# Altium schematic sheet [1] - POWER.SchDoc
size A
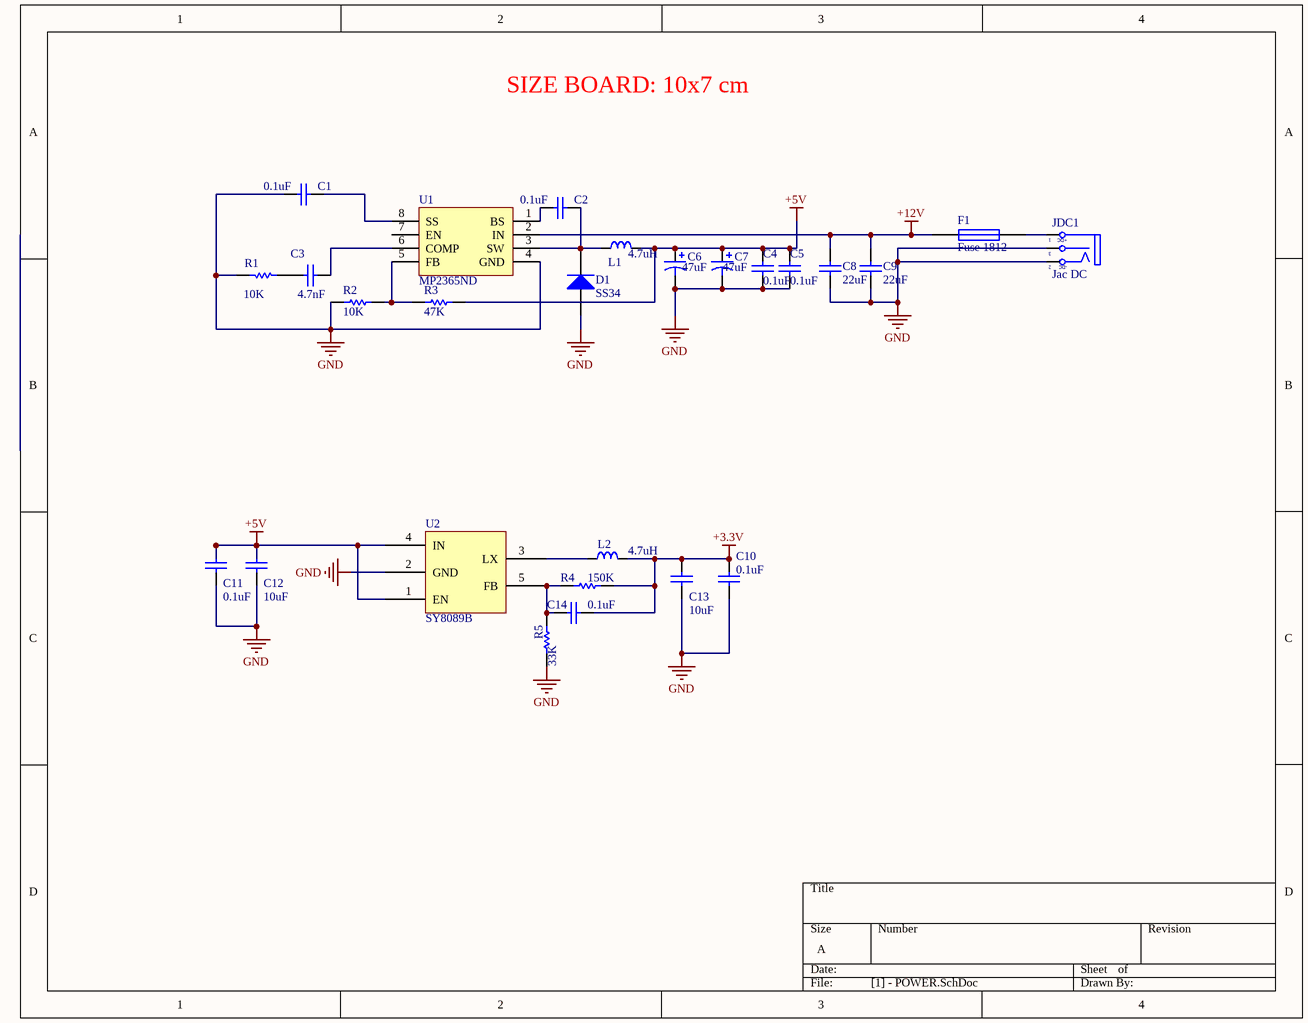
[diagram p0: [1] - POWER.SchDoc]

## Parts
C1  0.1uF  [CN-SMD-0603]
C2  0.1uF  [CN-SMD-0603]
C3  4.7nF  [CN-SMD-0603]
C4  0.1uF  [CN-SMD-0603]
C5  0.1uF  [CN-SMD-0603]
C6  47uF  [Cap size C]
C7  47uF  [Cap size C]
C8  22uF  [CN-SMD-0805]
C9  22uF  [CN-SMD-0805]
C10  0.1uF  [CN-SMD-0603]
C11  0.1uF  [CN-SMD-0603]
C12  10uF  [CN-SMD-0805]
C13  10uF  [CN-SMD-0805]
C14  0.1uF  [CN-SMD-0603]
D1  SS34  [DO-214AC]
F1  Fuse 1812  [fuse_1812]
JDC1  Jac DC  [DC0]
L1  4.7uH  [INDUCTOR CD75]
L2  4.7uH  [INDUCTOR CD75]
R1  10K  [RES 0603]
R2  10K  [RES 0603]
R3  47K  [RES 0603]
R4  150K  [RES 0603]
R5  33K  [RES 0603]
U1  MP2365ND  [MP2365ND]
U2  SY8089B  [SOT23-5]

## Nets
+3.3V: C10.1 C13.2 C14.1 L2.2 R4.1
+5V: C4.2 C5.2 C6.1 C7.1 C11.2 C12.2 L1.1 R3.2 U2.1(EN) U2.4(IN)
+12V: C8.1 C9.2 F1.1 U1.2(IN)
GND: C1.1 C4.1 C5.1 C6.2 C7.2 C8.2 C9.1 C10.2 C11.1 C12.1 C13.1 D1.1(A) JDC1.2(TN) JDC1.3(S) R1.2 R2.1 R5.1 U1.4(GND) U2.2(GND)
NetC1_2: C1.2 U1.8(SS)
NetC2_1: C2.1 U1.1(BS)
NetC2_2: C2.2 D1.2(K) L1.2 U1.3(SW)
NetC3_1: C3.1 R1.1
NetC3_2: C3.2 U1.6(COMP)
NetC14_2: C14.2 R4.2 R5.2 U2.5(FB)
NetF1_2: F1.2 JDC1.1(T)
NetL2_1: L2.1 U2.3(LX)
NetR2_2: R2.2 R3.1 U1.5(FB)

Not connected (* = marked no-connect by the designer): U1 7(EN)

## Notes on the sheet
- SIZE BOARD: 10x7 cm
- (in symbol DCIN_1) +DC; -DC

## Library data of the parts
C1 C2 C4 C5 C10 C11 C14 = CN0603-0.1uF: CC0603KPX7R9BB104 0603 0.1 uF 50 V ±10% Tolerance X7R SMT Multilayer Ceramic Capacitor; Manufacturer 1: Yageo; Capacitance: 100nF; Voltage Rating: 50V; Supplier 1: Digi-Key; Manufacturer Part Number 1: CC0603KPX7R9BB104; Stock 1: 190619; Pricing 1: 1=0.10000, 10=0.06200, 100=0.02780, 500=0.01988, 1000=0.01562, 2500=0.01420, 5000=0.01306 (USD); Mount: Surface Mount; Case/Package: 0603; Number of Pins: 2; Weight: 7.1E-05oz; Case Code (Imperial): 0603; Case Code (Metric): 1608; Min Operating Temperature: -55°C; Max Operating Temperature: 125°C; Tolerance: 10%; Packaging: Tape and Reel; Dielectric: X7R; Voltage Rating (DC): 50V; Termination: SMD/SMT; Composition: Ceramic; Length: 1.6mm; Height: 0.8mm; Width: 0.031inch; Thickness: 0.035inch; Depth: 0.8mm; Radiation Hardening: No; Lead Free: Lead Free; Halogen Free: Halogen Free; ComponentLink1URL: https://datasheet.ciiva.com/26829/getdatasheetpartid-653026-26829414.pdf?src-supplier=Verical; ComponentLink1Description: https://datasheet.ciiva.com/26829/getdatasheetpartid-653026-26829414.pdf?src-supplier=Verical; ComponentLink2URL: http://datasheet.octopart.com/CC0603KPX7R9BB104-Yageo-datasheet-10883670.pdf; ComponentLink2Description: http://datasheet.octopart.com/CC0603KPX7R9BB104-Yageo-datasheet-10883670.pdf; ComponentLink3URL: http://datasheet.octopart.com/CC0603KPX7R9BB104-Yageo-datasheet-68298032.pdf?src-supplier=Future+Electronics; ComponentLink3Description: http://datasheet.octopart.com/CC0603KPX7R9BB104-Yageo-datasheet-68298032.pdf?src-supplier=Future+Electronics; ComponentLink4URL: http://datasheet.octopart.com/CC0603KPX7R9BB104-Yageo-datasheet-78855685.pdf?src-supplier=Future+Electronics; ComponentLink4Description: http://datasheet.octopart.com/CC0603KPX7R9BB104-Yageo-datasheet-78855685.pdf?src-supplier=Future+Electronics; ComponentLink5URL: http://datasheet.octopart.com/CC0603KPX7R9BB104-Yageo-datasheet-82288757.pdf?src-supplier=Future+Electronics; ComponentLink5Description: http://datasheet.octopart.com/CC0603KPX7R9BB104-Yageo-datasheet-82288757.pdf?src-supplier=Future+Electronics; ComponentLink6URL: http://datasheet.octopart.com/CC0603KPX7R9BB104-Yageo-datasheet-137700084.pdf?src-supplier=Future+Electronics; ComponentLink6Description: http://datasheet.octopart.com/CC0603KPX7R9BB104-Yageo-datasheet-137700084.pdf?src-supplier=Future+Electronics
C3 = CN0603-4.7nF: CC0603KRX7R9BB472 Surface Mount Ceramic Multilayer Capacitor 0.0047uF 10% X7R 50V 0603 Paper T/R; Manufacturer 1: Yageo; Insulation Resistance: 10GR; Dissipation Factor: 2.5%; Supplier 1: Digi-Key; Manufacturer Part Number 1: CC0603KRX7R9BB472; Stock 1: 731800; Pricing 1: 1=0.10000, 10=0.05200, 100=0.02320, 500=0.01656, 1000=0.01301 (USD); Mount: Surface Mount; Case/Package: 0603; Number of Pins: 2; Case Code (Imperial): 0603; Case Code (Metric): 1608; Dielectric Material: Ceramic; Material: Ceramic; Min Operating Temperature: -55°C; Max Operating Temperature: 125°C; Capacitance: 4.7nF; Voltage Rating: 50V; Voltage Rating (DC): 50V; Tolerance: 10%; Packaging: Tape and Reel; Dielectric: X7R; Composition: Ceramic; Termination: SMD/SMT; Package Quantity: 1; Voltage: 50V; Length: 1.6mm; Height: 0.8mm; Width: 0.8mm; Thickness: 0.035inch; Depth: 0.8mm; Radiation Hardening: No; Lead Free: Lead Free; Halogen Free: Halogen Free; REACH SVHC: Unknown; ComponentLink1URL: https://datasheet.ciiva.com/144/mlccorderingcode-144445.pdf?src-supplier=Digi-Key; ComponentLink1Description: https://datasheet.ciiva.com/144/mlccorderingcode-144445.pdf?src-supplier=Digi-Key; ComponentLink2URL: https://datasheet.ciiva.com/144/mlccorderingcode-144446.pdf?src-supplier=Digi-Key; ComponentLink2Description: https://datasheet.ciiva.com/144/mlccorderingcode-144446.pdf?src-supplier=Digi-Key; ComponentLink3URL: https://datasheet.ciiva.com/144/mlccorderingcode-144447.pdf?src-supplier=Digi-Key; ComponentLink3Description: https://datasheet.ciiva.com/144/mlccorderingcode-144447.pdf?src-supplier=Digi-Key; ComponentLink4URL: https://datasheet.ciiva.com/11464/upy-gphc-x7r-6-3v-to-50v-8-11464743.pdf?src-supplier=Avnet; ComponentLink4Description: https://datasheet.ciiva.com/11464/upy-gphc-x7r-6-3v-to-50v-8-11464743.pdf?src-supplier=Avnet; ComponentLink5URL: https://datasheet.ciiva.com/16625/upy-gphc-x7r-6-3v-to-50v-8-16625534.pdf?src-supplier=Avnet+Europe; ComponentLink5Description: https://datasheet.ciiva.com/16625/upy-gphc-x7r-6-3v-to-50v-8-16625534.pdf?src-supplier=Avnet+Europe; ComponentLink6URL: https://datasheet.ciiva.com/8033/1489800-8033903.pdf?src-supplier=Element14; ComponentLink6Description: https://datasheet.ciiva.com/8033/1489800-8033903.pdf?src-supplier=Element14; ComponentLink7URL: http://datasheet.octopart.com/CC0603KRX7R9BB472-Yageo-datasheet-10883670.pdf; ComponentLink7Description: http://datasheet.octopart.com/CC0603KRX7R9BB472-Yageo-datasheet-10883670.pdf; ComponentLink8URL: http://datasheet.octopart.com/CC0603KRX7R9BB472-Yageo-datasheet-62336348.pdf?src-supplier=Newark; ComponentLink8Description: http://datasheet.octopart.com/CC0603KRX7R9BB472-Yageo-datasheet-62336348.pdf?src-supplier=Newark; ComponentLink9URL: http://datasheet.octopart.com/CC0603KRX7R9BB472-Yageo-datasheet-5301394.pdf?src-supplier=Newark; ComponentLink9Description: http://datasheet.octopart.com/CC0603KRX7R9BB472-Yageo-datasheet-5301394.pdf?src-supplier=Newark; ComponentLink10URL: http://datasheet.octopart.com/CC0603KRX7R9BB472-Yageo-datasheet-15895757.pdf?src-supplier=Future+Electronics; ComponentLink10Description: http://datasheet.octopart.com/CC0603KRX7R9BB472-Yageo-datasheet-15895757.pdf?src-supplier=Future+Electronics; ComponentLink11URL: http://datasheet.octopart.com/CC0603KRX7R9BB472-Yageo-datasheet-27626582.pdf?src-supplier=Future+Electronics; ComponentLink11Description: http://datasheet.octopart.com/CC0603KRX7R9BB472-Yageo-datasheet-27626582.pdf?src-supplier=Future+Electronics; ComponentLink12URL: http://datasheet.octopart.com/CC0603KRX7R9BB472-Yageo-datasheet-30457685.pdf?src-supplier=Seeed+Studio; ComponentLink12Description: http://datasheet.octopart.com/CC0603KRX7R9BB472-Yageo-datasheet-30457685.pdf?src-supplier=Seeed+Studio; ComponentLink13URL: http://datasheet.octopart.com/CC0603KRX7R9BB472-Yageo-datasheet-17600895.pdf?src-supplier=TME; ComponentLink13Description: http://datasheet.octopart.com/CC0603KRX7R9BB472-Yageo-datasheet-17600895.pdf?src-supplier=TME; ComponentLink14URL: http://datasheet.octopart.com/CC0603KRX7R9BB472-Yageo-datasheet-137700084.pdf?src-supplier=Future+Electronics; ComponentLink14Description: http://datasheet.octopart.com/CC0603KRX7R9BB472-Yageo-datasheet-137700084.pdf?src-supplier=Future+Electronics; ComponentLink15URL: http://datasheet.octopart.com/CC0603KRX7R9BB472-Yageo-datasheet-118396.pdf?src-supplier=Digi-Key; ComponentLink15Description: http://datasheet.octopart.com/CC0603KRX7R9BB472-Yageo-datasheet-118396.pdf?src-supplier=Digi-Key; ComponentLink16URL: http://datasheet.octopart.com/CC0603KRX7R9BB472-Yageo-datasheet-8324192.pdf?src-supplier=Future+Electronics; ComponentLink16Description: http://datasheet.octopart.com/CC0603KRX7R9BB472-Yageo-datasheet-8324192.pdf?src-supplier=Future+Electronics; ComponentLink17URL: http://datasheet.octopart.com/CC0603KRX7R9BB472-Yageo-datasheet-499490.pdf?src-supplier=Element14; ComponentLink17Description: http://datasheet.octopart.com/CC0603KRX7R9BB472-Yageo-datasheet-499490.pdf?src-supplier=Element14; ComponentLink18URL: http://datasheet.octopart.com/CC0603KRX7R9BB472-Yageo-datasheet-8701427.pdf?src-supplier=Element14; ComponentLink18Description: http://datasheet.octopart.com/CC0603KRX7R9BB472-Yageo-datasheet-8701427.pdf?src-supplier=Element14; ComponentLink19URL: http://datasheet.octopart.com/CC0603KRX7R9BB472-Yageo-datasheet-12526321.pdf?src-supplier=Future+Electronics; ComponentLink19Description: http://datasheet.octopart.com/CC0603KRX7R9BB472-Yageo-datasheet-12526321.pdf?src-supplier=Future+Electronics
C6 C7 = CN6032-47uF: TPSC476M016R0350 CAP TANT 47UF 16V 20% 2312; Manufacturer 1: Kyocera AVX; Dielectric Material: Tantalum; ESR (Equivalent Series Resistance): 350mR; Polarity: Polar; Dissipation Factor: 6%; Supplier 1: Digi-Key; Manufacturer Part Number 1: TPSC476M016R0350; Stock 1: 3387; Pricing 1: 1=1.31000, 10=1.03500, 100=0.77630 (USD); RoHS: Yes; Mount: Surface Mount; Case/Package: Molded; Number of Pins: 2; Case Code (Imperial): 2312; Case Code (Metric): 6032; Min Operating Temperature: -55°C; Max Operating Temperature: 125°C; Capacitance: 47uF; Tolerance: 20%; Packaging: Tape and Reel; Voltage Rating: 16V; Package Quantity: 1; Termination: SMD/SMT; Voltage Rating (DC): 16V; Voltage: 16V; Features: General Purpose; Length: 6mm; Height: 2.8mm; Depth: 3.2mm; Width: 3.2mm; Height - Seated (Max): 0.11inch; Radiation Hardening: No; REACH SVHC: No SVHC; Lead Free: Lead Free; ComponentLink1URL: https://datasheet.ciiva.com/264/tps-264405.pdf?src-supplier=Digi-Key; ComponentLink1Description: https://datasheet.ciiva.com/264/tps-264405.pdf?src-supplier=Digi-Key; ComponentLink2URL: https://datasheet.ciiva.com/264/tps-264406.pdf?src-supplier=Digi-Key; ComponentLink2Description: https://datasheet.ciiva.com/264/tps-264406.pdf?src-supplier=Digi-Key; ComponentLink3URL: https://datasheet.ciiva.com/22667/1724878-22667574.pdf?src-supplier=Element14; ComponentLink3Description: https://datasheet.ciiva.com/22667/1724878-22667574.pdf?src-supplier=Element14; ComponentLink4URL: https://datasheet.ciiva.com/264/tps-264407.pdf?src-supplier=Digi-Key; ComponentLink4Description: https://datasheet.ciiva.com/264/tps-264407.pdf?src-supplier=Digi-Key; ComponentLink5URL: https://datasheet.ciiva.com/28514/1724878-28514871.pdf?src-supplier=Element14; ComponentLink5Description: https://datasheet.ciiva.com/28514/1724878-28514871.pdf?src-supplier=Element14
C8 C9 = CN0805-22uF: CC0805MKX5R6BB226 0805 22 uF 10 V ±20 % Tolerance X5R SMT Multilayer Ceramic Capacitor; Manufacturer 1: Yageo; Tolerance: 20%; Voltage Rating: 10V; Supplier 1: Digi-Key; Manufacturer Part Number 1: CC0805MKX5R6BB226; Stock 1: 18000; Pricing 1: 1=0.41000, 10=0.28800, 100=0.17290, 500=0.12966, 1000=0.10950 (USD); Mount: Surface Mount; Case/Package: 0805; Weight: 0.000194oz; Case Code (Imperial): 0805; Case Code (Metric): 2012; Min Operating Temperature: -55°C; Max Operating Temperature: 85°C; Capacitance: 22uF; Packaging: Tape and Reel; Dielectric: X5R; Voltage Rating (DC): 10V; Termination: SMD/SMT; Composition: Ceramic; Length: 2mm; Width: 1.25mm; Thickness: 0.057inch; Depth: 1.25mm; Radiation Hardening: No; Lead Free: Lead Free; Halogen Free: Halogen Free; ComponentLink1URL: https://datasheet.ciiva.com/26863/getdatasheetpartid-573628-26863004.pdf?src-supplier=Verical; ComponentLink1Description: https://datasheet.ciiva.com/26863/getdatasheetpartid-573628-26863004.pdf?src-supplier=Verical; ComponentLink2URL: http://datasheet.octopart.com/CC0805MKX5R6BB226-Yageo-datasheet-24580494.pdf?src-supplier=Future+Electronics; ComponentLink2Description: http://datasheet.octopart.com/CC0805MKX5R6BB226-Yageo-datasheet-24580494.pdf?src-supplier=Future+Electronics; ComponentLink3URL: http://datasheet.octopart.com/CC0805MKX5R6BB226-Yageo-datasheet-27626583.pdf?src-supplier=Future+Electronics; ComponentLink3Description: http://datasheet.octopart.com/CC0805MKX5R6BB226-Yageo-datasheet-27626583.pdf?src-supplier=Future+Electronics; ComponentLink4URL: http://datasheet.octopart.com/CC0805MKX5R6BB226-Yageo-datasheet-86397281.pdf?src-supplier=Future+Electronics; ComponentLink4Description: http://datasheet.octopart.com/CC0805MKX5R6BB226-Yageo-datasheet-86397281.pdf?src-supplier=Future+Electronics
C12 C13 = CN0805_10uF: CC0805KKX5R8BB106 0805 10 uF 25 V ±10 % Tolerance X5R SMT Multilayer Ceramic Capacitor; Manufacturer 1: Yageo; Tolerance: 10%; Voltage Rating: 25V; Supplier 1: Digi-Key; Manufacturer Part Number 1: CC0805KKX5R8BB106; Stock 1: 905270; Pricing 1: 1=0.48000, 10=0.33500, 100=0.20100, 500=0.15076, 1000=0.12730 (USD); Mount: Surface Mount; Case/Package: 0805; Weight: 0.000194oz; Case Code (Imperial): 0805; Case Code (Metric): 2012; Min Operating Temperature: -55°C; Max Operating Temperature: 85°C; Capacitance: 10uF; Packaging: Tape and Reel; Dielectric: X5R; Voltage Rating (DC): 25V; Composition: Ceramic; Termination: SMD/SMT; Length: 0.079inch; Width: 0.049inch; Depth: 1.25mm; Thickness: 0.057inch; Lead Free: Lead Free; Halogen Free: Halogen Free; ComponentLink1URL: http://www.mouser.com/ds/2/447/UPY-GPHC_X5R_4V-to-50V_25-1131599.pdf?src-supplier=Mouser; ComponentLink1Description: http://www.mouser.com/ds/2/447/UPY-GPHC_X5R_4V-to-50V_25-1131599.pdf?src-supplier=Mouser; ComponentLink2URL: http://components.arrow.com/part/dataview/0323_04166572?src-supplier=Arrow+Europe; ComponentLink2Description: http://components.arrow.com/part/dataview/0323_04166572?src-supplier=Arrow+Europe; ComponentLink3URL: http://www.yageo.com/documents/recent/UPY-GPHC_X5R_4V-to-50V_25.pdf?src-supplier=Digi-Key; ComponentLink3Description: http://www.yageo.com/documents/recent/UPY-GPHC_X5R_4V-to-50V_25.pdf?src-supplier=Digi-Key; ComponentLink4URL: http://datasheet.octopart.com/CC0805KKX5R8BB106-Yageo-datasheet-14389981.pdf?src-supplier=Seeed+Studio; ComponentLink4Description: http://datasheet.octopart.com/CC0805KKX5R8BB106-Yageo-datasheet-14389981.pdf?src-supplier=Seeed+Studio; ComponentLink5URL: http://datasheet.octopart.com/CC0805KKX5R8BB106-Yageo-datasheet-78855687.pdf?src-supplier=Future+Electronics; ComponentLink5Description: http://datasheet.octopart.com/CC0805KKX5R8BB106-Yageo-datasheet-78855687.pdf?src-supplier=Future+Electronics; ComponentLink6URL: http://datasheet.octopart.com/CC0805KKX5R8BB106-Yageo-datasheet-86397281.pdf?src-supplier=Future+Electronics; ComponentLink6Description: http://datasheet.octopart.com/CC0805KKX5R8BB106-Yageo-datasheet-86397281.pdf?src-supplier=Future+Electronics
D1 = Diode_SS34: SS34 DIODE SCHOTTKY 40V 3A SMC; Manufacturer 1: ON Semiconductor / Fairchild; Element Configuration: Single; Peak Reverse Current: 500uA; Max Forward Surge Current (Ifsm): 100A; Forward Voltage: 500mV; Polarity: Standard; Max Power Dissipation: 2.27W; Number of Elements: 1; Supplier 1: Digi-Key; Manufacturer Part Number 1: SS34; Stock 1: 1630; Pricing 1: 1=0.47000, 10=0.40600, 100=0.30310, 500=0.23816, 1000=0.18403 (USD); RoHS: Yes; Mount: Surface Mount; Case/Package: SMC; Number of Pins: 2; Contact Plating: Tin,Matte; Number of Terminals: 2; Min Operating Temperature: -55°C; Max Operating Temperature: 150°C; Packaging: Tape and Reel; Package Quantity: 1; Current Rating: 3A; Voltage Rating (DC): 40V; Forward Current: 3A; Max Repetitive Reverse Voltage (Vrrm): 40V; Output Current: 3A; Peak Non-Repetitive Surge Current: 100A; Average Rectified Current: 3A; Max Reverse Voltage (DC): 40V; Max Surge Current: 100A; Max Reverse Leakage Current: 500uA; Current: 3A; Voltage: 40V; Length: 7.15mm; Height: 2.75mm; Width: 6.25mm; Radiation Hardening: No; Lead Free: Lead Free; REACH SVHC: No SVHC; ComponentLink1URL: https://datasheet.ciiva.com/911/ss34-911088.pdf?src-supplier=Avnet; ComponentLink1Description: https://datasheet.ciiva.com/911/ss34-911088.pdf?src-supplier=Avnet; ComponentLink2URL: https://datasheet.ciiva.com/4715/ss34-197057-4715255.pdf?src-supplier=Mouser; ComponentLink2Description: https://datasheet.ciiva.com/4715/ss34-197057-4715255.pdf?src-supplier=Mouser; ComponentLink3URL: https://datasheet.ciiva.com/34301/1090087-34301975.pdf?src-supplier=Jameco; ComponentLink3Description: https://datasheet.ciiva.com/34301/1090087-34301975.pdf?src-supplier=Jameco; ComponentLink4URL: https://datasheet.ciiva.com/23832/1725604-23832651.pdf?src-supplier=Newark; ComponentLink4Description: https://datasheet.ciiva.com/23832/1725604-23832651.pdf?src-supplier=Newark; ComponentLink5URL: https://datasheet.ciiva.com/34302/1547649-34302462.pdf?src-supplier=Jameco; ComponentLink5Description: https://datasheet.ciiva.com/34302/1547649-34302462.pdf?src-supplier=Jameco; ComponentLink6URL: https://datasheet.ciiva.com/911/ss34-911086.pdf?src-supplier=Digi-Key; ComponentLink6Description: https://datasheet.ciiva.com/911/ss34-911086.pdf?src-supplier=Digi-Key; ComponentLink7URL: https://datasheet.ciiva.com/8300/ss39-8300583.pdf?src-supplier=Avnet; ComponentLink7Description: https://datasheet.ciiva.com/8300/ss39-8300583.pdf?src-supplier=Avnet; ComponentLink8URL: https://datasheet.ciiva.com/911/ss34-911085.pdf?src-supplier=Digi-Key; ComponentLink8Description: https://datasheet.ciiva.com/911/ss34-911085.pdf?src-supplier=Digi-Key; ComponentLink9URL: https://datasheet.ciiva.com/7965/1774678-7965245.pdf?src-supplier=Element14; ComponentLink9Description: https://datasheet.ciiva.com/7965/1774678-7965245.pdf?src-supplier=Element14; ComponentLink10URL: https://datasheet.ciiva.com/911/ss34-911087.pdf?src-supplier=Digi-Key; ComponentLink10Description: https://datasheet.ciiva.com/911/ss34-911087.pdf?src-supplier=Digi-Key
F1 = Fuse 1: Fuse; Manufacturer: Littelfuse; Manufacturer Part Number: MINISMDC150F/24-2; Hold Current: 1.5A; Voltage Rating (DC): 24V; Supplier 1: Digi-Key; RoHS: No; Stock 1: 56020; Pricing 1: 1 = 0.66000, 5 = 0.64400, 10 = 0.62400, 50 = 0.52480, 100 = 0.43560, 250 = 0.39600, 500 = 0.33660 (USD); Min Operating Temperature: -40°C; Max Operating Temperature: 85°C; Lead Free: Lead Free; REACH SVHC: Unknown; ComponentLink1URL: http://www.farnell.com/datasheets/2282569.pdf?src-supplier=Farnell; ComponentLink1Description: http://www.farnell.com/datasheets/2282569.pdf?src-supplier=Farnell; ComponentLink2URL: http://www.farnell.com/datasheets/1468628.pdf?src-supplier=Farnell; ComponentLink2Description: http://www.farnell.com/datasheets/1468628.pdf?src-supplier=Farnell; ComponentLink3URL: http://www.littelfuse.com/~/media/electronics/datasheets/resettable_ptcs/littelfuse_ptc_minismd_catalog_datasheet.pdf.pdf?src-supplier=Digi-Key; ComponentLink3Description: http://www.littelfuse.com/~/media/electronics/datasheets/resettable_ptcs/littelfuse_ptc_minismd_catalog_datasheet.pdf.pdf?src-supplier=Digi-Key; ComponentLink4URL: http://www.farnell.com/datasheets/1468628.pdf?src-supplier=Element14; ComponentLink4Description: http://www.farnell.com/datasheets/1468628.pdf?src-supplier=Element14; Supplier Part Number 1: MINISMDC150F24-2CT-ND
JDC1 = DCIN_1: Jac DC input; Value: Jac DC
L1 L2 = L-4.7uH: CDRH5D28RHPNP-4R7NC Fixed Inductors 4.7uH 3.05A; Manufacturer 1: Sumida; Core Material: Ferrite; Saturation Current: 3.7A; Shielding: Shielded; Tolerance: 25%; Current Rating: 2.8A; DC Resistance (DCR): 43.1mR; Test Frequency: 100kHz; Supplier 1: Digi-Key; Stock 1: 50646; Pricing 1: 1=1.53000, 10=1.42000, 100=1.02700, 500=0.78660, 1000=0.69920 (USD); Mount: Surface Mount; Case/Package: Nonstandard; Min Operating Temperature: -40°C; Max Operating Temperature: 105°C; Packaging: Tape and Reel; Inductance: 4.7uH; Max DC Current: 3.7A; Termination: SMD/SMT; Length: 0.236inch; Height: 3mm; Width: 0.232inch; Height - Seated (Max): 0.118inch; Depth: 6.2mm; Radiation Hardening: No; Lead Free: Lead Free; ComponentLink1URL: http://www.mouser.com/ds/2/390/CDRH5D28RHP-523509.pdf?src-supplier=Mouser; ComponentLink1Description: http://www.mouser.com/ds/2/390/CDRH5D28RHP-523509.pdf?src-supplier=Mouser; ComponentLink2URL: http://products.sumida.com/products/pdf/CDRH5D28RHP.pdf?src-supplier=Digi-Key; ComponentLink2Description: http://products.sumida.com/products/pdf/CDRH5D28RHP.pdf?src-supplier=Digi-Key; ComponentLink3URL: http://www.sumida.com/products/pdf/CDRH5D28,5D28R,5D28RHP.pdf?src-supplier=Avnet; ComponentLink3Description: http://www.sumida.com/products/pdf/CDRH5D28,5D28R,5D28RHP.pdf?src-supplier=Avnet; Supplier Part Number 1: 4.7uH; Manufacturer Part Number 1: CDRH5D28RHPNP-4R7NC; RoHS: Yes
R1 R2 = RC0603_10K: AC0603FR-0710KL Res Thick Film 0603 10K Ohm 1% 0.1W(1/10W) ±100ppm/C Pad SMD Automotive T/R; Manufacturer 1: Yageo; Resistance: 10kR; Temperature Coefficient: 100ppm/°C; Power Rating: 100mW; Voltage Rating: 50V; ComponentLink1URL: https://datasheet.ciiva.com/26862/getdatasheetpartid-724997-26862461.pdf?src-supplier=Verical; ComponentLink1Description: https://datasheet.ciiva.com/26862/getdatasheetpartid-724997-26862461.pdf?src-supplier=Verical; ComponentLink2URL: http://datasheet.octopart.com/AC0603FR-0710KL-Yageo-datasheet-12512238.pdf; ComponentLink2Description: http://datasheet.octopart.com/AC0603FR-0710KL-Yageo-datasheet-12512238.pdf; ComponentLink3URL: http://datasheet.octopart.com/AC0603FR-0710KL-Yageo-datasheet-13029202.pdf?src-supplier=Future+Electronics; ComponentLink3Description: http://datasheet.octopart.com/AC0603FR-0710KL-Yageo-datasheet-13029202.pdf?src-supplier=Future+Electronics; ComponentLink4URL: http://datasheet.octopart.com/AC0603FR-0710KL-Yageo-datasheet-24580492.pdf?src-supplier=Future+Electronics; ComponentLink4Description: http://datasheet.octopart.com/AC0603FR-0710KL-Yageo-datasheet-24580492.pdf?src-supplier=Future+Electronics; ComponentLink5URL: http://datasheet.octopart.com/AC0603FR-0710KL-Yageo-datasheet-137699919.pdf?src-supplier=Future+Electronics; ComponentLink5Description: http://datasheet.octopart.com/AC0603FR-0710KL-Yageo-datasheet-137699919.pdf?src-supplier=Future+Electronics; Supplier 1: Newark; Manufacturer Part Number 1: AC0603FR-0710KL; Stock 1: 0; Mount: Surface Mount; Case/Package: 0603; Case Code (Imperial): 0603; Case Code (Metric): 1608; Min Operating Temperature: -55°C; Max Operating Temperature: 155°C; Tolerance: 1%; Packaging: Tape and Reel; Military Standard: Not; Termination: SMD/SMT; Composition: Thick Film; Package Quantity: 1; Number of Terminations: 2; Max Power Dissipation: 100mW; Features: Moisture Resistant; Length: 1.6mm; Height: 0.022inch; Depth: 0.8mm; Width: 0.8mm; Lead Free: Lead Free; Supplier Part Number 1: 10K
R3 = RC0603_47K: AC0603JR-0747KL Res Thick Film 0603 47K Ohm 5% 0.1W(1/10W) +/-100ppm/ßC Epoxy SMD Automotive T/R; Manufacturer 1: Yageo; Resistance: 47kR; Temperature Coefficient: 100ppm/°C; Max Power Dissipation: 100mW; Voltage Rating: 50V; Supplier 1: Digi-Key; Manufacturer Part Number 1: AC0603JR-0747KL; Stock 1: 79182; Pricing 1: 1=0.10000, 10=0.02300, 100=0.00940, 1000=0.00421, 2500=0.00366 (USD); Case/Package: 0603; Case Code (Imperial): 0603; Case Code (Metric): 1608; Min Operating Temperature: -55°C; Max Operating Temperature: 155°C; Packaging: Tape and Reel; Tolerance: 5%; Composition: Thick Film; Number of Terminations: 2; Features: Moisture Resistant; Termination: SMD/SMT; Power Rating: 100mW; Length: 0.063inch; Height: 0.022inch; Width: 0.031inch; ComponentLink1URL: http://www.mouser.com/ds/2/447/yageodocoutput-1111992.pdf?src-supplier=Mouser; ComponentLink1Description: http://www.mouser.com/ds/2/447/yageodocoutput-1111992.pdf?src-supplier=Mouser; ComponentLink2URL: http://www.yageo.com/NewPortal/yageodocoutput?fileName=/pdf/R-Chip/PYu-AC_51_RoHS_L_6.pdf&src-supplier=Digi-Key; ComponentLink2Description: http://www.yageo.com/NewPortal/yageodocoutput?fileName=/pdf/R-Chip/PYu-AC_51_RoHS_L_6.pdf&src-supplier=Digi-Key; ComponentLink3URL: http://datasheet.octopart.com/AC0603JR-0747KL-Yageo-datasheet-12512238.pdf; ComponentLink3Description: http://datasheet.octopart.com/AC0603JR-0747KL-Yageo-datasheet-12512238.pdf; ComponentLink4URL: http://datasheet.octopart.com/AC0603JR-0747KL-Yageo-datasheet-83209224.pdf?src-supplier=Future+Electronics; ComponentLink4Description: http://datasheet.octopart.com/AC0603JR-0747KL-Yageo-datasheet-83209224.pdf?src-supplier=Future+Electronics; ComponentLink5URL: http://datasheet.octopart.com/AC0603JR-0747KL-Yageo-datasheet-137699919.pdf?src-supplier=Future+Electronics; ComponentLink5Description: http://datasheet.octopart.com/AC0603JR-0747KL-Yageo-datasheet-137699919.pdf?src-supplier=Future+Electronics
R4 = RC0603_150K: RC0603JR-07150KL Res Thick Film 1.6 x 0.8 mm 150K Ohm 5% 0.1W(1/10W) 100ppm/ C Molded SMD Paper T/R; Manufacturer 1: Yageo; Resistance: 150kR; Temperature Coefficient: 100ppm/°C; Voltage Rating (DC): 50V; Power Rating: 100mW; Working Voltage: 75V; Supplier 1: Digi-Key; Manufacturer Part Number 1: RC0603JR-07150KL; Stock 1: 721120; Pricing 1: 1=0.10000, 10=0.01900, 100=0.00770, 1000=0.00347, 2500=0.00301 (USD); Case/Package: 0603; Number of Pins: 2; Case Code (Imperial): 0603; Case Code (Metric): 1608; Min Operating Temperature: -55°C; Max Operating Temperature: 155°C; Tolerance: 5%; Packaging: Tape and Reel; Composition: Thick Film; Number of Terminations: 2; Termination: SMD/SMT; Military Standard: Not; Voltage Rating: 50V; Package Quantity: 5000; Length: 1.6mm; Height: 0.45mm; Width: 0.8mm; Depth: 0.8mm; Lead Free: Lead Free; REACH SVHC: No SVHC; ComponentLink1URL: https://datasheet.ciiva.com/7746/443971-7746439.pdf?src-supplier=Element14; ComponentLink1Description: https://datasheet.ciiva.com/7746/443971-7746439.pdf?src-supplier=Element14; ComponentLink2URL: https://datasheet.ciiva.com/6068/443971-6068184.pdf?src-supplier=Farnell; ComponentLink2Description: https://datasheet.ciiva.com/6068/443971-6068184.pdf?src-supplier=Farnell; ComponentLink3URL: https://datasheet.ciiva.com/7746/443971-7746440.pdf?src-supplier=Element14; ComponentLink3Description: https://datasheet.ciiva.com/7746/443971-7746440.pdf?src-supplier=Element14; ComponentLink4URL: https://datasheet.ciiva.com/12557/rc0603-272842-12557962.pdf?src-supplier=Mouser; ComponentLink4Description: https://datasheet.ciiva.com/12557/rc0603-272842-12557962.pdf?src-supplier=Mouser; ComponentLink5URL: https://datasheet.ciiva.com/6068/443971-6068092.pdf?src-supplier=Farnell; ComponentLink5Description: https://datasheet.ciiva.com/6068/443971-6068092.pdf?src-supplier=Farnell; ComponentLink6URL: https://datasheet.ciiva.com/46395/443971-46395086.pdf?src-supplier=Element14; ComponentLink6Description: https://datasheet.ciiva.com/46395/443971-46395086.pdf?src-supplier=Element14; ComponentLink7URL: http://datasheet.octopart.com/RC0603JR-07150KL-Yageo-datasheet-137700087.pdf?src-supplier=Future+Electronics; ComponentLink7Description: http://datasheet.octopart.com/RC0603JR-07150KL-Yageo-datasheet-137700087.pdf?src-supplier=Future+Electronics; ComponentLink8URL: http://datasheet.octopart.com/RC0603JR-07150KL-Yageo-datasheet-8328172.pdf?src-supplier=Newark; ComponentLink8Description: http://datasheet.octopart.com/RC0603JR-07150KL-Yageo-datasheet-8328172.pdf?src-supplier=Newark; ComponentLink9URL: http://datasheet.octopart.com/RC0603JR-07150KL-Yageo-datasheet-62067350.pdf?src-supplier=Element14; ComponentLink9Description: http://datasheet.octopart.com/RC0603JR-07150KL-Yageo-datasheet-62067350.pdf?src-supplier=Element14; ComponentLink10URL: http://datasheet.octopart.com/RC0603JR-07150KL-Yageo-datasheet-34211833.pdf?src-supplier=Element14; ComponentLink10Description: http://datasheet.octopart.com/RC0603JR-07150KL-Yageo-datasheet-34211833.pdf?src-supplier=Element14; ComponentLink11URL: http://datasheet.octopart.com/RC0603JR-07150KL-Yageo-datasheet-12596169.pdf?src-supplier=Future+Electronics; ComponentLink11Description: http://datasheet.octopart.com/RC0603JR-07150KL-Yageo-datasheet-12596169.pdf?src-supplier=Future+Electronics; ComponentLink12URL: http://datasheet.octopart.com/RC0603JR-07150KL-Yageo-datasheet-27584510.pdf?src-supplier=Future+Electronics; ComponentLink12Description: http://datasheet.octopart.com/RC0603JR-07150KL-Yageo-datasheet-27584510.pdf?src-supplier=Future+Electronics; ComponentLink13URL: http://datasheet.octopart.com/RC0603JR-07150KL-Yageo-datasheet-30459151.pdf?src-supplier=Seeed+Studio; ComponentLink13Description: http://datasheet.octopart.com/RC0603JR-07150KL-Yageo-datasheet-30459151.pdf?src-supplier=Seeed+Studio; ComponentLink14URL: http://datasheet.octopart.com/RC0603JR-07150KL-Yageo-datasheet-73766026.pdf; ComponentLink14Description: http://datasheet.octopart.com/RC0603JR-07150KL-Yageo-datasheet-73766026.pdf; ComponentLink15URL: http://datasheet.octopart.com/RC0603JR-07150KL-Yageo-datasheet-118562.pdf?src-supplier=Digi-Key; ComponentLink15Description: http://datasheet.octopart.com/RC0603JR-07150KL-Yageo-datasheet-118562.pdf?src-supplier=Digi-Key; ComponentLink16URL: http://datasheet.octopart.com/RC0603JR-07150KL-Yageo-datasheet-8324193.pdf?src-supplier=Future+Electronics; ComponentLink16Description: http://datasheet.octopart.com/RC0603JR-07150KL-Yageo-datasheet-8324193.pdf?src-supplier=Future+Electronics; ComponentLink17URL: http://datasheet.octopart.com/RC0603JR-07150KL-Yageo-datasheet-15599030.pdf?src-supplier=Future+Electronics; ComponentLink17Description: http://datasheet.octopart.com/RC0603JR-07150KL-Yageo-datasheet-15599030.pdf?src-supplier=Future+Electronics
R5 = RC0603_33K: AC0603JR-0733KL Res Thick Film 0603 33K Ohm 5% 0.1W(1/10W) ±100ppm/C Pad SMD Automotive T/R; Manufacturer 1: Yageo; Resistance: 33kR; Temperature Coefficient: 100ppm/°C; Power Rating: 100mW; Voltage Rating: 50V; Supplier 1: Digi-Key; Manufacturer Part Number 1: AC0603JR-0733KL; Stock 1: 20130; Pricing 1: 1=0.10000, 10=0.02300, 100=0.00940, 1000=0.00421, 2500=0.00366 (USD); Case/Package: 0603; Case Code (Imperial): 0603; Case Code (Metric): 1608; Min Operating Temperature: -55°C; Max Operating Temperature: 155°C; Tolerance: 5%; Packaging: Tape and Reel; Composition: Thick Film; Termination: SMD/SMT; Length: 0.063inch; Height: 0.022inch; Width: 0.8mm; ComponentLink1URL: http://www.mouser.com/ds/2/447/yageodocoutput-1111992.pdf?src-supplier=Mouser; ComponentLink1Description: http://www.mouser.com/ds/2/447/yageodocoutput-1111992.pdf?src-supplier=Mouser; ComponentLink2URL: http://www.yageo.com/NewPortal/yageodocoutput?fileName=/pdf/R-Chip/PYu-AC_51_RoHS_L_6.pdf&src-supplier=Digi-Key; ComponentLink2Description: http://www.yageo.com/NewPortal/yageodocoutput?fileName=/pdf/R-Chip/PYu-AC_51_RoHS_L_6.pdf&src-supplier=Digi-Key; Number of Terminations: 2; Max Power Dissipation: 100mW; Features: Moisture Resistant; ComponentLink3URL: http://datasheet.octopart.com/AC0603JR-0733KL-Yageo-datasheet-12512238.pdf; ComponentLink3Description: http://datasheet.octopart.com/AC0603JR-0733KL-Yageo-datasheet-12512238.pdf; ComponentLink4URL: http://datasheet.octopart.com/AC0603JR-0733KL-Yageo-datasheet-83209224.pdf?src-supplier=Future+Electronics; ComponentLink4Description: http://datasheet.octopart.com/AC0603JR-0733KL-Yageo-datasheet-83209224.pdf?src-supplier=Future+Electronics; ComponentLink5URL: http://datasheet.octopart.com/AC0603JR-0733KL-Yageo-datasheet-137699919.pdf?src-supplier=Future+Electronics; ComponentLink5Description: http://datasheet.octopart.com/AC0603JR-0733KL-Yageo-datasheet-137699919.pdf?src-supplier=Future+Electronics
U1 = Switching MP2365ND: Manufacturer: Monolithic Power Systems; Manufacturer Part Number: MP2365DN-LF-Z; Max Input Voltage: 28V; Output Voltage: 21V; Output Current: 3A; Min Input Voltage: 4.75V; Nominal Supply Current: 1.3mA; Number of Outputs: 1; Min Output Voltage: 920mV; Switching Frequency: 1.4MHz; Synchronous Rectifier: No; Output Type: Adjustable; Output Configuration: Positive; Supplier 1: Digi-Key; Stock 1: 2848; Pricing 1: 1 = 4.47000, 10 = 3.99100, 25 = 3.59200, 100 = 3.27280, 250 = 2.95352, 500 = 2.65020, 1000 = 2.23510 (USD); Mount: Surface Mount; Case/Package: SOIC; Contact Plating: Tin; Min Operating Temperature: -40°C; Max Operating Temperature: 85°C; Packaging: Tape and Reel; Package Quantity: 2500; Max Output Voltage: 21V; Radiation Hardening: No; Lead Free: Lead Free; ComponentLink1URL: http://www.mouser.com/ds/2/277/MP2365_r1.01-480735.pdf?src-supplier=Mouser; ComponentLink1Description: http://www.mouser.com/ds/2/277/MP2365_r1.01-480735.pdf?src-supplier=Mouser; ComponentLink2URL: http://www.monolithicpower.com/Page/DownLoad.aspx?ListID=149b7d2b-0bb2-4ba6-a219-a0495acb8b0b&&ItemID=36&src-supplier=Avnet; ComponentLink2Description: http://www.monolithicpower.com/Page/DownLoad.aspx?ListID=149b7d2b-0bb2-4ba6-a219-a0495acb8b0b&&ItemID=36&src-supplier=Avnet; ComponentLink3URL: http://www.monolithicpower.com/DesktopModules/DocumentManage/API/Document/getDocument?id=287&src-supplier=Digi-Key; ComponentLink3Description: http://www.monolithicpower.com/DesktopModules/DocumentManage/API/Document/getDocument?id=287&src-supplier=Digi-Key; ComponentLink4URL: http://www.monolithicpower.com/DesktopModules/DocumentManage/API/Document/GetDocument?id=287&src-supplier=Avnet+Asia; ComponentLink4Description: http://www.monolithicpower.com/DesktopModules/DocumentManage/API/Document/GetDocument?id=287&src-supplier=Avnet+Asia; ComponentLink5URL: http://datasheet.octopart.com/MP2365DN-LF-Z-Monolithic-Power-Systems-datasheet-13697211.pdf?src-supplier=Future+Electronics; ComponentLink5Description: http://datasheet.octopart.com/MP2365DN-LF-Z-Monolithic-Power-Systems-datasheet-13697211.pdf?src-supplier=Future+Electronics; ComponentLink6URL: http://datasheet.octopart.com/MP2365DN-LF-Z-Monolithic-Power-Systems-datasheet-28362030.pdf?src-supplier=Future+Electronics; ComponentLink6Description: http://datasheet.octopart.com/MP2365DN-LF-Z-Monolithic-Power-Systems-datasheet-28362030.pdf?src-supplier=Future+Electronics; Supplier Part Number 1: 1589-1115-1-ND
U2 = SY8089B: High Efficiency 5.5V, 2A continuous, 3A peak, 1MHz  Synchronous Step Down Regulator; Manufacturer: Silergy; Manufacturer Part Number: SY8089A; Suppiler 1: China; Suppiler Part Number 1: SY8089A; Case/Package: SOT23-5